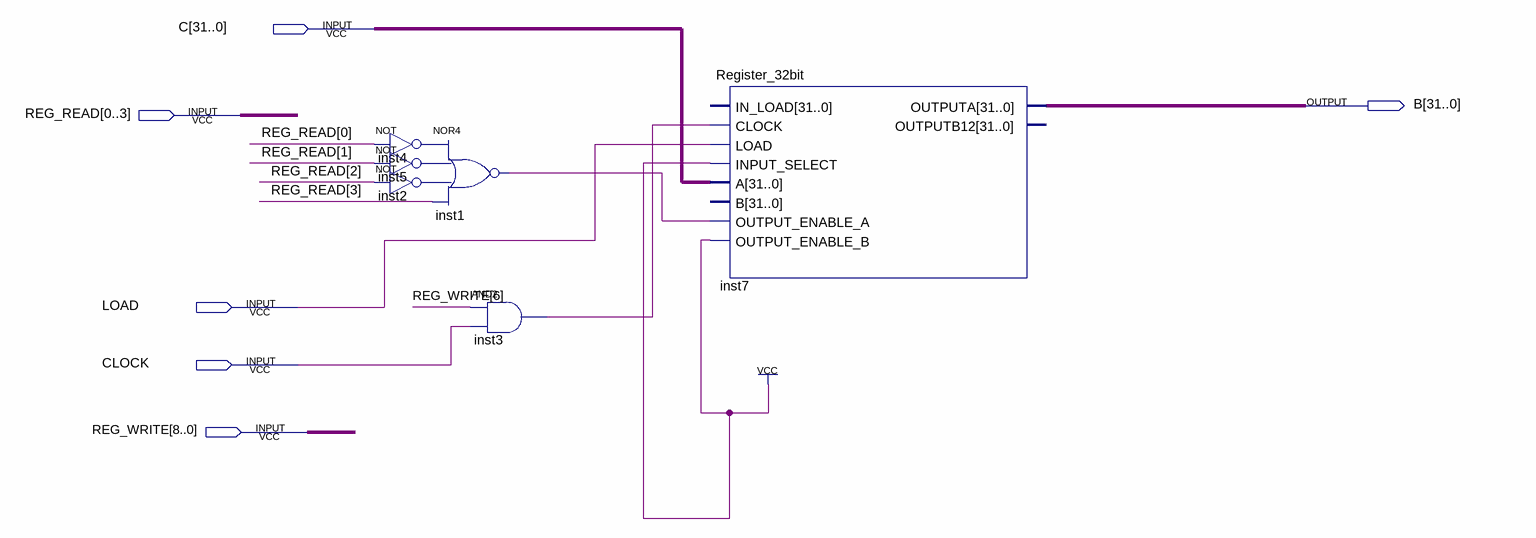
[diagram p0: schematic sheet]
// Quartus schematic TOS.bdf as structural Verilog: 6 symbols, 6 pins
module TOS (
  input  [31:0] C,
  input  [0:3] REG_READ,
  input  LOAD,
  input  CLOCK,
  input  [8:0] REG_WRITE,
  output [31:0] B
);

  wire inst1_out, inst2_out, inst3_out, inst4_out, inst5_out;

  nor inst1 (inst1_out, inst4_out, inst5_out, inst2_out, REG_READ[3]);
  not inst4 (inst4_out, REG_READ[0]);
  not inst5 (inst5_out, REG_READ[1]);
  not inst2 (inst2_out, REG_READ[2]);
  and inst3 (inst3_out, REG_WRITE[6], CLOCK);
  Register_32bit inst7 (
    .CLOCK(inst3_out), .LOAD(LOAD), .INPUT_SELECT(1'b1), .A(C), .OUTPUT_ENABLE_A(inst1_out),
    .OUTPUT_ENABLE_B(1'b1), .OUTPUTA(B));  // open: IN_LOAD, B, OUTPUTB12
endmodule
